# Altium schematic sheet power-sheet.SchDoc: Power Regulator
size 420 x 297 mm; CheckedBy: E.Orzes F.Martina S.Baron; CompanyName: CERN; DrawnBy: E.Orzes; Organization: CERN; Address1: European Organization for Nuclear Research; Address2: CH-1211 Genève 23 - Switzerland; SheetNumber: 6; SheetTotal: 6; Projet: Phase Stable Link; DivGrp: EP-ESE; Designer: E.Orzes; ModifiedDate: -
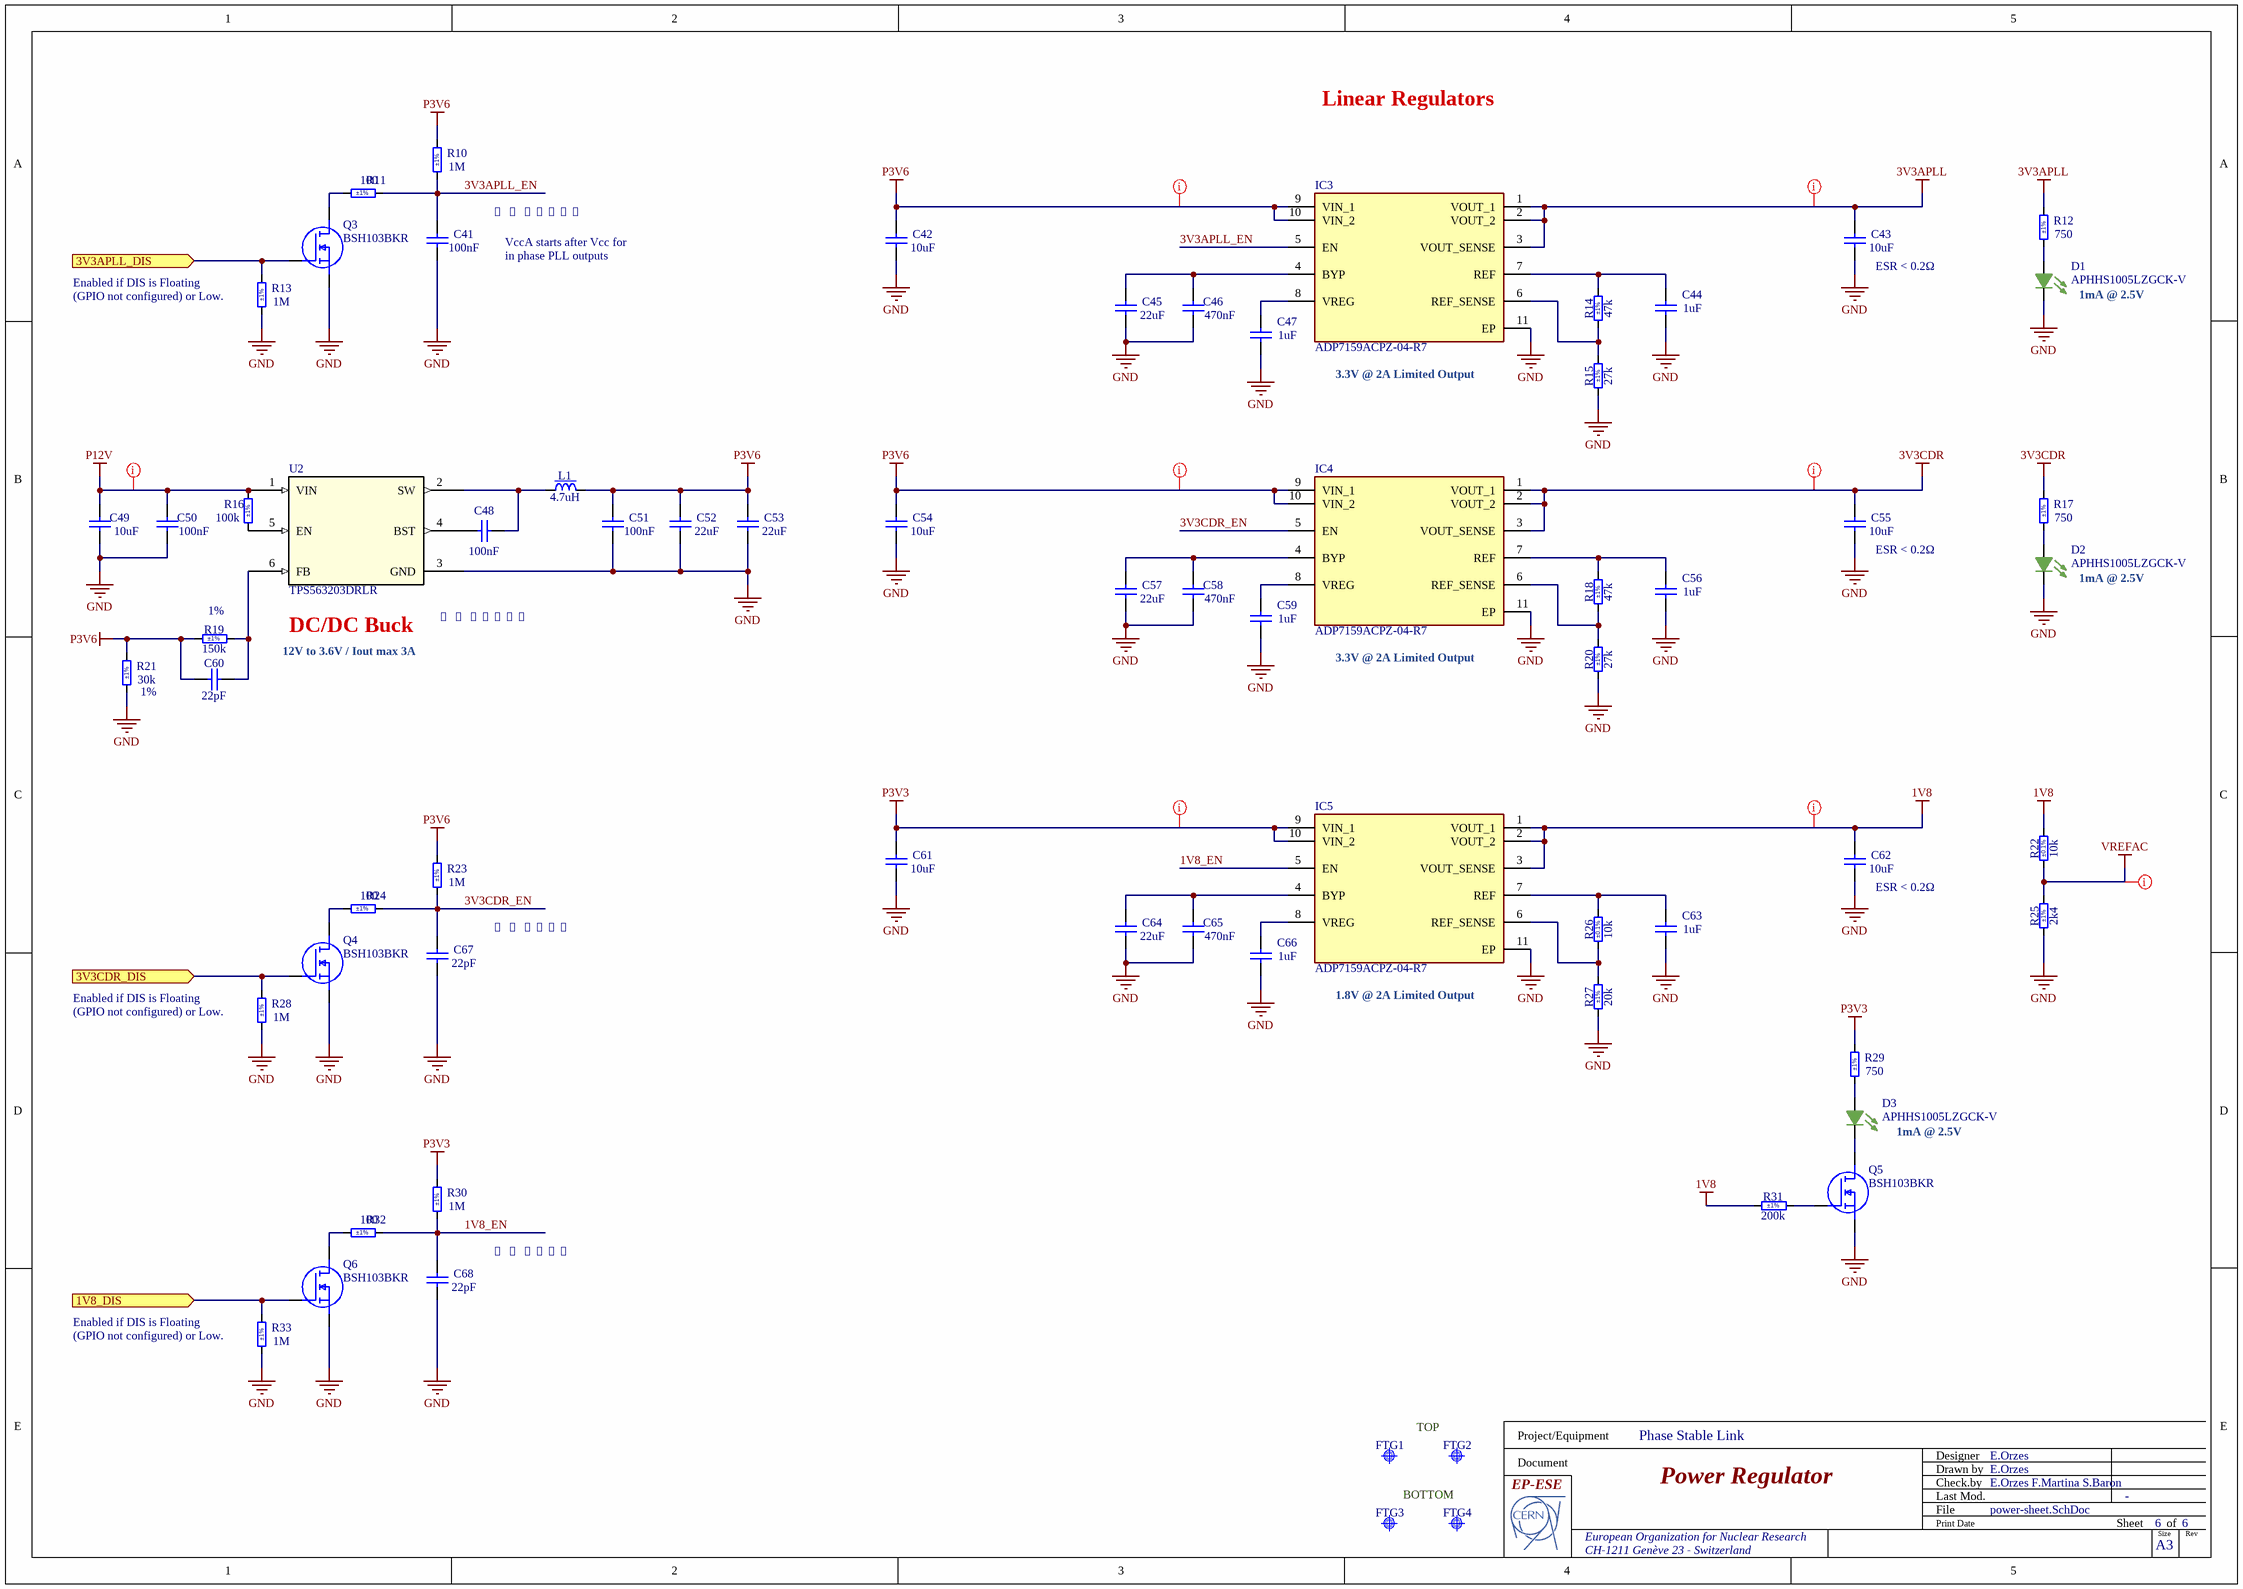
[diagram p0: power-sheet.SchDoc]

## Parts
C41  100nF  [CAPC0603X33N]
C42  10uF  [CAPC1608X87N]
C43  10uF  [CAPC1608X87N]
C44  1uF  [CAPC1005X55N]
C45  22uF  [CAPC1005X70N]
C46  470nF  [CAPC0510X04N]
C47  1uF  [CAPC1005X55N]
C48  100nF  [CAPC0603X33N]
C49  10uF  [CAPC2012X135N]
C50  100nF  [CAPC0603X33N]
C51  100nF  [CAPC0603X33N]
C52  22uF  [CAPC1005X70N]
C53  22uF  [CAPC1005X70N]
C54  10uF  [CAPC1608X87N]
C55  10uF  [CAPC1608X87N]
C56  1uF  [CAPC1005X55N]
C57  22uF  [CAPC1005X70N]
C58  470nF  [CAPC0510X04N]
C59  1uF  [CAPC1005X55N]
C60  22pF  [CAPC0603X33N]
C61  10uF  [CAPC1608X87N]
C62  10uF  [CAPC1608X87N]
C63  1uF  [CAPC1005X55N]
C64  22uF  [CAPC1005X70N]
C65  470nF  [CAPC0510X04N]
C66  1uF  [CAPC1005X55N]
C67  22pF  [CAPC0603X33N]
C68  22pF  [CAPC0603X33N]
D1  APHHS1005LZGCK-V  [LED_APHHS1005LZGCK-V]
D2  APHHS1005LZGCK-V  [LED_APHHS1005LZGCK-V]
D3  APHHS1005LZGCK-V  [LED_APHHS1005LZGCK-V]
FTG1  Use only in PCB  [FIDUCIAL_TOP_C100-200]  (value not drawn)
FTG2  Use only in PCB  [FIDUCIAL_TOP_C100-200]  (value not drawn)
FTG3  Use only in PCB  [FIDUCIAL_TOP_C100-200]  (value not drawn)
FTG4  Use only in PCB  [FIDUCIAL_TOP_C100-200]  (value not drawn)
IC3  ADP7159ACPZ-04-R7  [SON50P300X300X85-11N-D]
IC4  ADP7159ACPZ-04-R7  [SON50P300X300X85-11N-D]
IC5  ADP7159ACPZ-04-R7  [SON50P300X300X85-11N-D]
L1  4.7uH  [IND_MURATA_LQH32C]
Q3  BSH103BKR  [SOT95P230X110-3N]
Q4  BSH103BKR  [SOT95P230X110-3N]
Q5  BSH103BKR  [SOT95P230X110-3N]
Q6  BSH103BKR  [SOT95P230X110-3N]
R10  1M  Tolerance: ±1%  [RESC1005X40N]
R11  100  Tolerance: ±1%  [RESC0603X28N]
R12  750  Tolerance: ±1%  [RESC1005X40N]
R13  1M  Tolerance: ±1%  [RESC1005X40N]
R14  47k  Tolerance: ±1%  [RESC1005X40N]
R15  27k  Tolerance: ±1%  [RESC1005X40N]
R16  100k  Tolerance: ±1%  [RESC1005X40N]
R17  750  Tolerance: ±1%  [RESC1005X40N]
R18  47k  Tolerance: ±1%  [RESC1005X40N]
R19  150k  Tolerance: ±1%  [RESC1608X55N]
R20  27k  Tolerance: ±1%  [RESC1005X40N]
R21  30k  Tolerance: ±1%  [RESC1608X55N]
R22  10k  Tolerance: ±0.1%  [RESC3216X65N]
R23  1M  Tolerance: ±1%  [RESC1005X40N]
R24  100  Tolerance: ±1%  [RESC0603X28N]
R25  2k4  Tolerance: ±1%  [RESC3216X65N]
R26  10k  Tolerance: ±0.1%  [RESC1005X35N]
R27  20k  Tolerance: ±1%  [RESC1005X40N]
R28  1M  Tolerance: ±1%  [RESC1005X40N]
R29  750  Tolerance: ±1%  [RESC1005X40N]
R30  1M  Tolerance: ±1%  [RESC1005X40N]
R31  200k  Tolerance: ±1%  [RESC1005X40N]
R32  100  Tolerance: ±1%  [RESC0603X28N]
R33  1M  Tolerance: ±1%  [RESC1005X40N]
U2  TPS563203DRLR  [SOT_07SDRLR_TEX]

## Ports
1V8_DIS (in), 3V3APLL_DIS (in), 3V3CDR_DIS (in)

## Nets
1V8: C62.2 IC5.1(VOUT_1) IC5.2(VOUT_2) IC5.3(VOUT_SENSE) R22.2 R31.1
3V3APLL: C43.2 IC3.1(VOUT_1) IC3.2(VOUT_2) IC3.3(VOUT_SENSE) R12.2
3V3CDR: C55.2 IC4.1(VOUT_1) IC4.2(VOUT_2) IC4.3(VOUT_SENSE) R17.2
GND: C41.1 C42.1 C43.1 C44.1 C45.1 C46.1 C47.1 C49.1 C50.1 C51.1 C52.1 C53.1 C54.1 C55.1 C56.1 C57.1 C58.1 C59.1 C61.1 C62.1 C63.1 C64.1 C65.1 C66.1 C67.1 C68.1 D1.1(C) D2.1(C) IC3.11(EP) IC4.11(EP) IC5.11(EP) Q3.2(S) Q4.2(S) Q5.2(S) Q6.2(S) R13.1 R15.1 R20.1 R21.1 R25.1 R27.1 R28.1 R33.1 U2.3(GND)
P3V3: C61.2 IC5.9(VIN_1) IC5.10(VIN_2) R29.2 R30.2
P3V6: C42.2 C51.2 C52.2 C53.2 C54.2 C60.1 IC3.9(VIN_1) IC3.10(VIN_2) IC4.9(VIN_1) IC4.10(VIN_2) L1.2 R10.2 R19.1 R21.2 R23.2
P12V: C49.2 C50.2 R16.2 U2.1(VIN)
VREFAC: R22.1 R25.2
1V8_DIS: Q6.1(G) R33.2 ; port 1V8_DIS
1V8_EN: C68.2 IC5.5(EN) R30.1 R32.2
3V3APLL_DIS: Q3.1(G) R13.2 ; port 3V3APLL_DIS
3V3APLL_EN: C41.2 IC3.5(EN) R10.1 R11.2
3V3CDR_DIS: Q4.1(G) R28.2 ; port 3V3CDR_DIS
3V3CDR_EN: C67.2 IC4.5(EN) R23.1 R24.2
NetC44_2: C44.2 IC3.7(REF) R14.2
NetC45_2: C45.2 C46.2 IC3.4(BYP)
NetC47_2: C47.2 IC3.8(VREG)
NetC48_1: C48.1 L1.1 U2.2(SW)
NetC48_2: C48.2 U2.4(BST)
NetC56_2: C56.2 IC4.7(REF) R18.2
NetC57_2: C57.2 C58.2 IC4.4(BYP)
NetC59_2: C59.2 IC4.8(VREG)
NetC60_2: C60.2 R19.2 U2.6(FB)
NetC63_2: C63.2 IC5.7(REF) R26.2
NetC64_2: C64.2 C65.2 IC5.4(BYP)
NetC66_2: C66.2 IC5.8(VREG)
NetD1_2: D1.2(A) R12.1
NetD2_2: D2.2(A) R17.1
NetD3_1: D3.1(C) Q5.3(D)
NetD3_2: D3.2(A) R29.1
NetIC3_6: IC3.6(REF_SENSE) R14.1 R15.2
NetIC4_6: IC4.6(REF_SENSE) R18.1 R20.2
NetIC5_6: IC5.6(REF_SENSE) R26.1 R27.2
NetQ3_3: Q3.3(D) R11.1
NetQ4_3: Q4.3(D) R24.1
NetQ5_1: Q5.1(G) R31.2
NetQ6_3: Q6.3(D) R32.1
NetR16_1: R16.1 U2.5(EN)

## Layout directives
net class Power: 1V8, 3V3APLL, 3V3CDR, P3V3, P3V6, P12V, VREFAC

## Notes on the sheet
- Linear Regulators
- 𝜏 = 100ms
- VccA starts after Vcc for in phase PLL outputs
- (near R13) Enabled if DIS is Floating (GPIO not configured) or Low.
- (near C43) ESR < 0.2Ω
- 1mA @ 2.5V
- (near IC3) 3.3V @ 2A Limited Output
- (near C55) ESR < 0.2Ω
- (near R19) 1%
- 12V to 3.6V / Iout max 3A
- DC/DC Buck
- (near U2) 𝜏 = 1.6ms
- (near IC4) 3.3V @ 2A Limited Output
- (near R21) 1%
- 𝜏 = 22us
- (near C62) ESR < 0.2Ω
- (near IC5) 1.8V @ 2A Limited Output
- (near R28) Enabled if DIS is Floating (GPIO not configured) or Low.
- (near R33) Enabled if DIS is Floating (GPIO not configured) or Low.
- TOP
- BOTTOM
- Project/Equipment
- Document
- Designer
- Drawn by
- Check.by
- File
- Last Mod.
- Print Date
- Sheet
- Size
- A3
- of
- Rev

## Library data of the parts
C41 C48 C50 C51 = CC0201_100NF_6.3V_10%_X5R: GRM033R61C104KE14; Part Description: SMD Multilayer Chip Ceramic Capacitor; Manufacturer: GENERIC; Manufacturer1 Part Number: 02016D104KAT2A; Voltage: 6.3V; TC: X5R; Tolerance: ±10%; Part Number: CC0201_100NF_6.3V_10%_X5R; Component Kind: Standard; Component Type: Standard; Pin Count: 2; Value: 100nF; Status: Not Recommended; Manufacturer Part Number: CC0201_100NF_6.3V_10%_X5R; Case: 0201; Mounted: Yes; Socket: No; SMD: Yes; Sense: No; Manufacturer1 Example: AVX; Manufacturer1 ComponentHeight: 0.33mm; HelpURL: \\cern.ch\dfs\Applications\Altium\Datasheets\CC0201_X5R_AVX.pdf; Author: CERN DEM JLC; CreateDate: 12/3/2007; LatestRevisionDate: 12/3/2007
C42 C43 C54 C55 C61 C62 = CC0603_10UF_6.3V_20%_X5R: GRM188D71A106KA73; Part Description: SMD Multilayer Chip Ceramic Capacitor; Manufacturer: GENERIC; Manufacturer1 Part Number: C0603C106M9PAC; Voltage: 6.3V; TC: X5R; Tolerance: ±20%; Part Number: CC0603_10UF_6.3V_20%_X5R; Component Kind: Standard; Component Type: Standard; Pin Count: 2; Value: 10uF; Status: Preferred; Manufacturer Part Number: CC0603_10uF_6.3V_20%_X5R; Case: 0603; Mounted: Yes; Socket: No; SMD: Yes; Sense: No; Manufacturer1 Example: KEMET; Manufacturer1 ComponentHeight: 0.95mm; HelpURL: \\cern.ch\dfs\Applications\Altium\Datasheets\CC0603_X5R_KEMET.pdf; Author: CERN DEM JLC; CreateDate: 03/12/2007; LatestRevisionDate: 03/12/2007
C44 C47 C56 C59 C63 C66 = CC0402_1UF_16V_10%_X5R: GRM153B30J105ME15; Part Description: SMD Multilayer Chip Ceramic Capacitor; Manufacturer: GENERIC; Manufacturer1 Part Number: C1005X5R1C105KT; Voltage: 16V; TC: X5R; Tolerance: ±10%; Part Number: CC0402_1UF_16V_10%_X5R; Component Kind: Standard; Component Type: Standard; Pin Count: 2; Value: 1uF; Status: Preferred; Manufacturer Part Number: CC0402_1UF_16V_10%_X5R; Case: 0402; Mounted: Yes; Socket: No; SMD: Yes; Sense: No; Manufacturer1 Example: TDK; Manufacturer1 ComponentHeight: 0.55mm; HelpURL: \\cern.ch\dfs\Applications\Altium\Datasheets\CC0402_X5R_TDK_C.pdf; Author: CERN DEM JLC; CreateDate: 10/25/2012; LatestRevisionDate: 10/25/2012
C45 C52 C53 C57 C64 = CC0402_10UF_6.3V_20%_X5R: GRM155R60J226ME11; Part Description: SMD Multilayer Chip Ceramic Capacitor; Manufacturer: GENERIC; Manufacturer1 Part Number: C1005X5R0J106M050; Value: 10uF; Voltage: 6.3V; TC: X5R; Tolerance: ±10%; Part Number: CC0402_10UF_6.3V_20%_X5R; Component Kind: Standard; Component Type: Standard; Pin Count: 2; Status: Preferred; Manufacturer Part Number: CC0402_10UF_6.3V_20%_X5R; Case: 0402; Mounted: Yes; Socket: No; SMD: Yes; Sense: No; Manufacturer1 Example: TDK; Manufacturer1 ComponentHeight: 0.70mm; HelpURL: \\cern.ch\dfs\Applications\Altium\Datasheets\CC0402_X5R_TDK_C.pdf; Author: CERN DEM JLC; CreateDate: 1/7/2015; LatestRevisionDate: 1/7/2015
C46 C58 C65 = Capacitor - non polarized: LLL153C70G474ME17; Value: 470nF
C49 = CC0805_10UF_16V_10%_X5R: GRM21BR61C106KE15; Part Description: SMD Multilayer Chip Ceramic Capacitor; Manufacturer: GENERIC; Manufacturer1 Part Number: C0805C106K4PAC; Voltage: 16V; TC: X5R; Tolerance: ±10%; Part Number: CC0805_10UF_16V_10%_X5R; Component Kind: Standard; Component Type: Standard; Pin Count: 2; Value: 10uF; Status: Preferred; Manufacturer Part Number: CC0805_10UF_16V_10%_X5R; Case: 0805; Mounted: Yes; Socket: No; SMD: Yes; Sense: No; Manufacturer1 Example: KEMET; Manufacturer1 ComponentHeight: 1.4mm; HelpURL: \\cern.ch\dfs\Applications\Altium\Datasheets\CC1206_X5R_KEMET.pdf; Author: CERN DEM JLC; CreateDate: 12/3/2007; LatestRevisionDate: 12/3/2007
C60 C67 C68 = CC0201_4.7NF_10V_10%_X5R: GJM0335C0J220GB01; Part Description: SMD Multilayer Chip Ceramic Capacitor; Manufacturer: GENERIC; Manufacturer1 Part Number: 0201ZD472KAT2A; Value: 4.7nF; Voltage: 10V; TC: X5R; Tolerance: ±10%; Part Number: CC0201_4.7NF_10V_10%_X5R; Component Kind: Standard; Component Type: Standard; Pin Count: 2; Status: Not Recommended; Manufacturer Part Number: CC0201_4.7NF_10V_10%_X5R; Case: 0201; Mounted: Yes; Socket: No; SMD: Yes; Sense: No; Manufacturer1 Example: AVX; Manufacturer1 ComponentHeight: 0.33mm; HelpURL: \\cern.ch\dfs\Applications\Altium\Datasheets\CC0201_X5R_AVX.pdf; Author: CERN DEM JLC; CreateDate: 12/3/2007; LatestRevisionDate: 12/3/2007
D1-D3 = APHHS1005LZGCK-V: Led Green 0402 2mA 2.65V 40mcd 102mW; MF: Kingbright Corporation; SnapEDA_Link: https://www.snapeda.com/parts/APHHS1005LZGCK-V/Kingbright/view-part/?ref=snap; Package: 0402 Kingbright Corporation; Value: *; MP: APHHS1005LZGCK-V; Check_prices: https://www.snapeda.com/parts/APHHS1005LZGCK-V/Kingbright/view-part/?ref=eda
FTG1-FTG4 = FIDUCIAL_TARGET_C100-200: Fiducial Target; Part Description: Round Fiducial Target, Top Layer, 1.0mm, Top Solder 2.0mm, Keepout =2.0mm; Mounted: No; Part Number: FIDUCIAL_TARGET_C100-200; Component Kind: Standard (No BOM); Component Type: Standard (No BOM); Pin Count: 1; Family: Fiducial; Socket: No; SMD: Yes; Sense: No; Status: None; ComponentHeight: 0mm; HelpURL: Undefined; Author: CERN DEM JLC; CreateDate: 09/02/2010; LatestRevisionDate: 04/04/2012; PackageDescription: Round Fiducial Target, Top Layer, 1.0mm, Top Solder 2.0mm, Keepout =2.0mm
IC3-IC5 = ADP7159ACPZ-04-R7: Integrated Circuit; Manufacturer_Name: Analog Devices; Datasheet Link: https://www.analog.com/media/en/technical-documentation/data-sheets/ADP7159.pdf; Height: 0.85mm; Manufacturer_Part_Number: ADP7159ACPZ-04-R7; Mouser Part Number: 584-ADP7159ACPZ04R7; Mouser Price/Stock: https://www.mouser.co.uk/ProductDetail/Analog-Devices/ADP7159ACPZ-04-R7?qs=JeIcUl65ClBXEAZRPtHUVQ%3D%3D; Arrow Part Number: ADP7159ACPZ-04-R7; Arrow Price/Stock: https://www.arrow.com/en/products/adp7159acpz-04-r7/analog-devices
L1 = IND_4.7UH_20%_MURATA_LQH32CN4R7M23L: Inductor With Core; Part Description: Chip Inductor (Chip Coil) for Choke Wire Wound Type; Manufacturer: MURATA; Power: 450mA; Resistance: 0.2R; Tolerance: ±20%; Part Number: IND_4.7UH_20%_MURATA_LQH32CN4R7M23L; Component Kind: Standard; Component Type: Standard; Pin Count: 2; Value: 4.7uH; Manufacturer Part Number: LQH32CN4R7M23; Mounted: Yes; Socket: No; SMD: Yes; Sense: No; ComponentHeight: 2.2mm; HelpURL: \\cern.ch\dfs\Applications\Altium\Datasheets\IND_MURATA_LQH32CN_23.pdf; Author: CERN DEM JLC; CreateDate: 4/20/2010; LatestRevisionDate: 7/4/2018
Q3-Q6 = BSH103BKR: MOSFET (N-Channel); Manufacturer_Name: Nexperia; Datasheet Link: https://ms.componentsearchengine.com/Datasheets/2/BSH103BKR.pdf; Height: 1.1mm; Manufacturer_Part_Number: BSH103BKR; Mouser Part Number: 771-BSH103BKR; Mouser Price/Stock: https://www.mouser.co.uk/ProductDetail/Nexperia/BSH103BKR?qs=GCAb4wyKXLKD%2FWt2ta8c7Q%3D%3D; Arrow Part Number: BSH103BKR; Arrow Price/Stock: https://www.arrow.com/en/products/bsh103bkr/nexperia?region=europe
R10 R13 R23 R28 R30 R33 = R0402_1M_1%_0.0625W_100PPM: Resistor - 1%; Part Description: General Purpose Thick Film Chip Resistor; Manufacturer: GENERIC; Manufacturer1 Part Number: 232270671005L; TC: ±100ppm/°C; PressFit: No; Part Number: R0402_1M_1%_0.0625W_100PPM; Component Kind: Standard; Component Type: Standard; Pin Count: 2; Value: 1M; Status: Not Recommended; Power: 0.0625W; Manufacturer Part Number: R0402_1M_1%_0.0625W_100PPM; Case: 0402; Mounted: Yes; Sense: No; Socket: No; SMD: Yes; Manufacturer1 Example: YAGEO PHYCOMP; Manufacturer1 ComponentHeight: 0.4mm; HelpURL: \\cern.ch\dfs\Applications\Altium\Datasheets\R0402_Phycomp_RC0402.pdf; Author: CERN DEM JLC; CreateDate: 12/3/2007; LatestRevisionDate: 10/17/2012
R11 R24 R32 = R0201_100R_1%_0.05W_200PPM: Resistor - 1%; Part Description: Thick Film Chip Resistor; Manufacturer: GENERIC; Manufacturer1 Part Number: CRCW0201100RFNED; Power: 0.05W; TC: ±200ppm/°C; PressFit: No; Part Number: R0201_100R_1%_0.05W_200PPM; Component Kind: Standard; Component Type: Standard; Pin Count: 2; Value: 100; Status: Not Recommended; Manufacturer Part Number: R0201_100R_1%_0.05W_200PPM; Case: 0201; Mounted: Yes; Sense: No; Socket: No; SMD: Yes; Manufacturer1 Example: VISHAY; Manufacturer1 ComponentHeight: 0.27mm; HelpURL: \\cern.ch\dfs\Applications\Altium\Datasheets\R0201_VISHAY_CRCW e3.pdf; Author: CERN DEM JLC; CreateDate: 11/13/2014; LatestRevisionDate: 11/13/2014
R12 R17 R29 = R0402_750R_1%_0.0625W_100PPM: Resistor - 1%; Part Description: General Purpose Thick Film Chip Resistor; Manufacturer: GENERIC; Manufacturer1 Part Number: 232270677501L; TC: ±100ppm/°C; PressFit: No; Part Number: R0402_750R_1%_0.0625W_100PPM; Component Kind: Standard; Component Type: Standard; Pin Count: 2; Value: 750; Status: Not Recommended; Power: 0.0625W; Manufacturer Part Number: R0402_750R_1%_0.0625W_100PPM; Case: 0402; Mounted: Yes; Sense: No; Socket: No; SMD: Yes; Manufacturer1 Example: YAGEO PHYCOMP; Manufacturer1 ComponentHeight: 0.4mm; HelpURL: \\cern.ch\dfs\Applications\Altium\Datasheets\R0402_Phycomp_RC0402.pdf; Author: CERN DEM JLC; CreateDate: 12/3/2007; LatestRevisionDate: 10/17/2012
R14 R18 = R0402_47K_1%_0.0625W_100PPM: Resistor - 1%; Part Description: General Purpose Thick Film Chip Resistor; Manufacturer: GENERIC; Manufacturer1 Part Number: 232270674703L; TC: ±100ppm/°C; PressFit: No; Part Number: R0402_47K_1%_0.0625W_100PPM; Component Kind: Standard; Component Type: Standard; Pin Count: 2; Value: 47k; Status: Not Recommended; Power: 0.0625W; Manufacturer Part Number: R0402_47K_1%_0.0625W_100PPM; Case: 0402; Mounted: Yes; Sense: No; Socket: No; SMD: Yes; Manufacturer1 Example: YAGEO PHYCOMP; Manufacturer1 ComponentHeight: 0.4mm; HelpURL: \\cern.ch\dfs\Applications\Altium\Datasheets\R0402_Phycomp_RC0402.pdf; Author: CERN DEM JLC; CreateDate: 12/3/2007; LatestRevisionDate: 10/17/2012
R15 R20 = R0402_27K_1%_0.0625W_100PPM: Resistor - 1%; Part Description: General Purpose Thick Film Chip Resistor; Manufacturer: GENERIC; Manufacturer1 Part Number: 232270672703L; TC: ±100ppm/°C; PressFit: No; Part Number: R0402_27K_1%_0.0625W_100PPM; Component Kind: Standard; Component Type: Standard; Pin Count: 2; Value: 27k; Status: Not Recommended; Power: 0.0625W; Manufacturer Part Number: R0402_27K_1%_0.0625W_100PPM; Case: 0402; Mounted: Yes; Sense: No; Socket: No; SMD: Yes; Manufacturer1 Example: YAGEO PHYCOMP; Manufacturer1 ComponentHeight: 0.4mm; HelpURL: \\cern.ch\dfs\Applications\Altium\Datasheets\R0402_Phycomp_RC0402.pdf; Author: CERN DEM JLC; CreateDate: 12/3/2007; LatestRevisionDate: 10/17/2012
R16 = R0402_100K_1%_0.0625W_100PPM: Resistor - 1%; Part Description: General Purpose Thick Film Chip Resistor; Manufacturer: GENERIC; Manufacturer1 Part Number: 232270671004L; TC: ±100ppm/°C; PressFit: No; Part Number: R0402_100K_1%_0.0625W_100PPM; Component Kind: Standard; Component Type: Standard; Pin Count: 2; Value: 100k; Status: Not Recommended; Power: 0.0625W; Manufacturer Part Number: R0402_100K_1%_0.0625W_100PPM; Case: 0402; Mounted: Yes; Sense: No; Socket: No; SMD: Yes; Manufacturer1 Example: YAGEO PHYCOMP; Manufacturer1 ComponentHeight: 0.4mm; HelpURL: \\cern.ch\dfs\Applications\Altium\Datasheets\R0402_Phycomp_RC0402.pdf; Author: CERN DEM JLC; CreateDate: 12/3/2007; LatestRevisionDate: 10/17/2012
R19 = R0603_150K_1%_0.1W_100PPM: Resistor - 1%; Part Description: General Purpose Thick Film Chip Resistor; Manufacturer: GENERIC; Manufacturer1 Part Number: NRC06F1503TRF; Power: 0.1W; TC: ±100ppm/°C; PressFit: No; Part Number: R0603_150K_1%_0.1W_100PPM; Component Kind: Standard; Component Type: Standard; Pin Count: 2; Value: 150k; Status: Preferred; Manufacturer Part Number: R0603_150K_1%_0.1W_100PPM; Case: 0603; Mounted: Yes; Sense: No; Socket: No; SMD: Yes; Manufacturer1 Example: NIC COMPONENT; Manufacturer1 ComponentHeight: 0.55mm; HelpURL: \\cern.ch\dfs\Applications\Altium\Datasheets\R0603_NIC_NRC.pdf; Author: CERN DEM JLC; CreateDate: 12/3/2007; LatestRevisionDate: 3/13/2008
R21 = R0603_30K_1%_0.1W_100PPM: Resistor - 1%; Part Description: General Purpose Thick Film Chip Resistor; Manufacturer: GENERIC; Manufacturer1 Part Number: NRC06F3002TRF; Power: 0.1W; TC: ±100ppm/°C; PressFit: No; Part Number: R0603_30K_1%_0.1W_100PPM; Component Kind: Standard; Component Type: Standard; Pin Count: 2; Value: 30k; Status: Preferred; Manufacturer Part Number: R0603_30K_1%_0.1W_100PPM; Case: 0603; Mounted: Yes; Sense: No; Socket: No; SMD: Yes; Manufacturer1 Example: NIC COMPONENT; Manufacturer1 ComponentHeight: 0.55mm; HelpURL: \\cern.ch\dfs\Applications\Altium\Datasheets\R0603_NIC_NRC.pdf; Author: CERN DEM JLC; CreateDate: 12/3/2007; LatestRevisionDate: 3/13/2008
R22 = R1206_10K_0.1%_0.25W_25PPM: Resistor - 0.1%; Part Description: Thin Film Chip Resistor; Manufacturer: GENERIC; Manufacturer1 Part Number: RN73H2BTTD1002B25; Power: 0.25W; TC: ±25ppm/°C; PressFit: No; Part Number: R1206_10K_0.1%_0.25W_25PPM; Component Kind: Standard; Component Type: Standard; Pin Count: 2; Value: 10k; Status: Not Recommended; Manufacturer Part Number: R1206_10K_0.1%_0.25W_25PPM; Case: 1206; Mounted: Yes; Sense: No; Socket: No; SMD: Yes; Manufacturer1 Example: KOA; Manufacturer1 ComponentHeight: 0.70mm; HelpURL: \\cern.ch\dfs\Applications\Altium\Datasheets\R1206_KOA_RN73H.pdf; Author: CERN DEM JLC; CreateDate: 12/3/2007; LatestRevisionDate: 11/1/2011
R25 = R1206_2K4_1%_0.25W_100PPM: Resistor - 1%; Part Description: General Purpose Thick Film Chip Resistor; Manufacturer: GENERIC; Manufacturer1 Part Number: NRC12F2401TRF; Power: 0.25W; TC: ±100ppm/°C; PressFit: No; Part Number: R1206_2K4_1%_0.25W_100PPM; Component Kind: Standard; Component Type: Standard; Pin Count: 2; Value: 2k4; Status: Preferred; Manufacturer Part Number: R1206_2K4_1%_0.25W_100PPM; Case: 1206; Mounted: Yes; Sense: No; Socket: No; SMD: Yes; Manufacturer1 Example: NIC COMPONENT; Manufacturer1 ComponentHeight: 0.65mm; HelpURL: \\cern.ch\dfs\Applications\Altium\Datasheets\R1206_NIC_NRC.pdf; Author: CERN DEM JLC; CreateDate: 12/3/2007; LatestRevisionDate: 3/13/2008
R26 = R0402_10K_0.1%_0.063W_25PPM: Resistor - 0.1%; Part Description: Thin Film Precision Resistor; Manufacturer: GENERIC; Manufacturer1 Part Number: CPF0402B10KE1; Power: 0.063W; TC: ±25ppm/°C; PressFit: No; Part Number: R0402_10K_0.1%_0.063W_25PPM; Component Kind: Standard; Component Type: Standard; Pin Count: 2; Value: 10k; Status: Not Recommended; Manufacturer Part Number: R0402_10K_0.1%_0.063W_25PPM; Case: 0402; Mounted: Yes; Sense: No; Socket: No; SMD: Yes; Manufacturer1 Example: TE CONNECTIVITY; Manufacturer1 ComponentHeight: 0.35mm; HelpURL: \\cern.ch\dfs\Applications\Altium\Datasheets\R0402_TYCO_CPF.pdf; Author: CERN DEM JMW; CreateDate: 9/22/2015; LatestRevisionDate: 9/22/2015
R27 = R0402_20K_1%_0.0625W_100PPM: Resistor - 1%; Part Description: General Purpose Thick Film Chip Resistor; Manufacturer: GENERIC; Manufacturer1 Part Number: 232270672003L; TC: ±100ppm/°C; PressFit: No; Part Number: R0402_20K_1%_0.0625W_100PPM; Component Kind: Standard; Component Type: Standard; Pin Count: 2; Value: 20k; Status: Not Recommended; Power: 0.0625W; Manufacturer Part Number: R0402_20K_1%_0.0625W_100PPM; Case: 0402; Mounted: Yes; Sense: No; Socket: No; SMD: Yes; Manufacturer1 Example: YAGEO PHYCOMP; Manufacturer1 ComponentHeight: 0.4mm; HelpURL: \\cern.ch\dfs\Applications\Altium\Datasheets\R0402_Phycomp_RC0402.pdf; Author: CERN DEM JLC; CreateDate: 12/3/2007; LatestRevisionDate: 10/17/2012
R31 = R0402_200K_1%_0.0625W_100PPM: Resistor - 1%; Part Description: General Purpose Thick Film Chip Resistor; Manufacturer: GENERIC; Manufacturer1 Part Number: 232270672004L; TC: ±100ppm/°C; PressFit: No; Part Number: R0402_200K_1%_0.0625W_100PPM; Component Kind: Standard; Component Type: Standard; Pin Count: 2; Value: 200k; Status: Not Recommended; Power: 0.0625W; Manufacturer Part Number: R0402_200K_1%_0.0625W_100PPM; Case: 0402; Mounted: Yes; Sense: No; Socket: No; SMD: Yes; Manufacturer1 Example: YAGEO PHYCOMP; Manufacturer1 ComponentHeight: 0.4mm; HelpURL: \\cern.ch\dfs\Applications\Altium\Datasheets\R0402_Phycomp_RC0402.pdf; Author: CERN DEM JLC; CreateDate: 12/3/2007; LatestRevisionDate: 10/17/2012
U2 = TPS563203DRLR: No Description Available; Mfr_Name: Texas Instruments; Type: Power Management; RefDes: RefDes